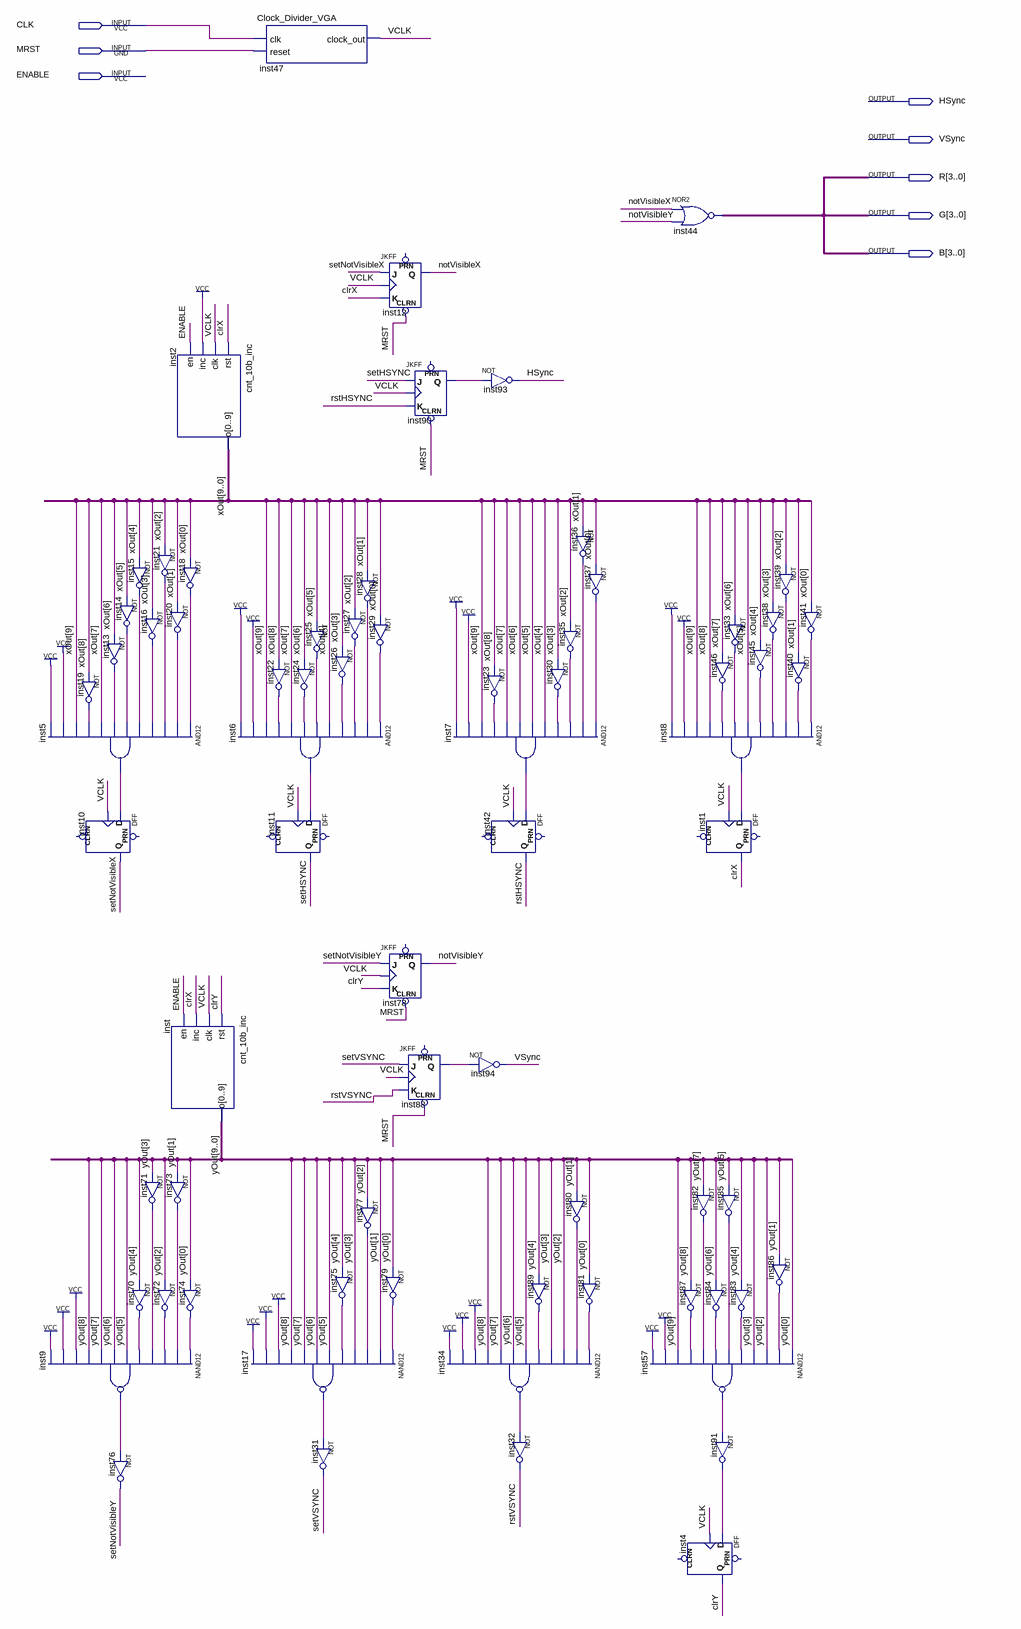
[diagram p0: schematic sheet]
// Quartus schematic VGAcontroller.bdf as structural Verilog: 71 symbols, 8 pins
module VGAcontroller (
  input  CLK,
  input  MRST,
  input  ENABLE,
  output HSync,
  output VSync,
  output [3:0] R,
  output [3:0] G,
  output [3:0] B
);

  wire clrX, clrY, inst5_out, inst6_out, inst7_out, inst8_out, inst9_out, inst13_out, inst14_out, inst15_out,
       inst16_out, inst17_out, inst18_out, inst19_out, inst20_out, inst21_out, inst22_out, inst23_out,
       inst24_out, inst25_out, inst26_out, inst27_out, inst28_out, inst29_out, inst30_out, inst33_out,
       inst34_out, inst35_out, inst36_out, inst37_out, inst38_out, inst39_out, inst40_out, inst41_out,
       inst45_out, inst46_out, inst57_out, inst70_out, inst71_out, inst72_out, inst73_out, inst74_out,
       inst75_out, inst77_out, inst79_out, inst80_out, inst81_out, inst82_out, inst83_out, inst84_out,
       inst85_out, inst86_out, inst87_out, inst88_q, inst89_out, inst90_q, inst91_out, notVisibleX,
       notVisibleY, rstHSYNC, rstVSYNC, setHSYNC, setNotVisibleX, setNotVisibleY, setVSYNC, VCLK;
  wire [9:0] xOut, yOut;

  not inst19 (inst19_out, xOut[8]);
  and inst5 (inst5_out, inst18_out, inst20_out, inst21_out, inst16_out, inst15_out, inst14_out, inst13_out, xOut[7], inst19_out, xOut[9], 1'b1, 1'b1);
  DFF inst10 (.CLK(VCLK), .D(inst5_out), .Q(setNotVisibleX));  // open: CLRN, PRN
  nand inst9 (inst9_out, inst74_out, inst73_out, inst72_out, inst71_out, inst70_out, yOut[5], yOut[6], yOut[7], yOut[8], 1'b1, 1'b1, 1'b1);
  not inst15 (inst15_out, xOut[4]);
  not inst14 (inst14_out, xOut[5]);
  not inst13 (inst13_out, xOut[6]);
  not inst70 (inst70_out, yOut[4]);
  not inst76 (setNotVisibleY, inst9_out);
  cnt_10b_inc inst2 (.rst(clrX), .clk(VCLK), .inc(1'b1), .en(ENABLE), .o(xOut));
  not inst21 (inst21_out, xOut[2]);
  not inst18 (inst18_out, xOut[0]);
  not inst20 (inst20_out, xOut[1]);
  not inst16 (inst16_out, xOut[3]);
  cnt_10b_inc inst (.rst(clrY), .clk(VCLK), .inc(clrX), .en(ENABLE), .o(yOut));
  not inst71 (inst71_out, yOut[3]);
  not inst73 (inst73_out, yOut[1]);
  not inst72 (inst72_out, yOut[2]);
  not inst74 (inst74_out, yOut[0]);
  and inst6 (inst6_out, inst29_out, inst28_out, inst27_out, inst26_out, xOut[4], inst25_out, inst24_out, xOut[7], inst22_out, xOut[9], 1'b1, 1'b1);
  Clock_Divider_VGA inst47 (.clk(CLK), .reset(MRST), .clock_out(VCLK));
  not inst22 (inst22_out, xOut[8]);
  DFF inst11 (.CLK(VCLK), .D(inst6_out), .Q(setHSYNC));  // open: CLRN, PRN
  nand inst17 (inst17_out, inst79_out, yOut[1], inst77_out, yOut[3], inst75_out, yOut[5], yOut[6], yOut[7], yOut[8], 1'b1, 1'b1, 1'b1);
  not inst25 (inst25_out, xOut[5]);
  not inst26 (inst26_out, xOut[3]);
  not inst24 (inst24_out, xOut[6]);
  not inst75 (inst75_out, yOut[4]);
  not inst31 (setVSYNC, inst17_out);
  JKFF inst12 (.CLRN(MRST), .K(clrX), .J(setNotVisibleX), .CLK(VCLK), .Q(notVisibleX));  // open: PRN
  not inst28 (inst28_out, xOut[1]);
  not inst27 (inst27_out, xOut[2]);
  not inst29 (inst29_out, xOut[0]);
  JKFF inst78 (.CLRN(MRST), .K(clrY), .J(setNotVisibleY), .CLK(VCLK), .Q(notVisibleY));  // open: PRN
  not inst77 (inst77_out, yOut[2]);
  not inst79 (inst79_out, yOut[0]);
  JKFF inst90 (.CLRN(MRST), .K(rstHSYNC), .J(setHSYNC), .CLK(VCLK), .Q(inst90_q));  // open: PRN
  JKFF inst88 (.CLRN(MRST), .K(rstVSYNC), .J(setVSYNC), .CLK(VCLK), .Q(inst88_q));  // open: PRN
  nand inst34 (inst34_out, inst81_out, inst80_out, yOut[2], yOut[3], inst89_out, yOut[5], yOut[6], yOut[7], yOut[8], 1'b1, 1'b1, 1'b1);
  not inst93 (HSync, inst90_q);
  not inst23 (inst23_out, xOut[8]);
  and inst7 (inst7_out, inst37_out, inst36_out, inst35_out, inst30_out, xOut[4], xOut[5], xOut[6], xOut[7], inst23_out, xOut[9], 1'b1, 1'b1);
  DFF inst42 (.CLK(VCLK), .D(inst7_out), .Q(rstHSYNC));  // open: CLRN, PRN
  not inst94 (VSync, inst88_q);
  not inst89 (inst89_out, yOut[4]);
  not inst32 (rstVSYNC, inst34_out);
  not inst36 (inst36_out, xOut[1]);
  not inst37 (inst37_out, xOut[0]);
  not inst35 (inst35_out, xOut[2]);
  not inst30 (inst30_out, xOut[3]);
  not inst80 (inst80_out, yOut[1]);
  not inst81 (inst81_out, yOut[0]);
  nand inst57 (inst57_out, yOut[0], inst86_out, yOut[2], yOut[3], inst83_out, inst85_out, inst84_out, inst82_out, inst87_out, yOut[9], 1'b1, 1'b1);
  assign B = ~({4{notVisibleX}} | {4{notVisibleY}});  // NOR2 inst44, 4 bits wide
  and inst8 (inst8_out, inst41_out, inst40_out, inst39_out, inst38_out, inst45_out, xOut[5], inst33_out, inst46_out, xOut[8], xOut[9], 1'b1, 1'b1);
  not inst82 (inst82_out, yOut[7]);
  not inst87 (inst87_out, yOut[8]);
  DFF inst4 (.CLK(VCLK), .D(inst91_out), .Q(clrY));  // open: CLRN, PRN
  not inst33 (inst33_out, xOut[6]);
  not inst46 (inst46_out, xOut[7]);
  DFF inst1 (.CLK(VCLK), .D(inst8_out), .Q(clrX));  // open: CLRN, PRN
  not inst85 (inst85_out, yOut[5]);
  not inst83 (inst83_out, yOut[4]);
  not inst84 (inst84_out, yOut[6]);
  not inst91 (inst91_out, inst57_out);
  not inst39 (inst39_out, xOut[2]);
  not inst38 (inst38_out, xOut[3]);
  not inst45 (inst45_out, xOut[4]);
  not inst40 (inst40_out, xOut[1]);
  not inst86 (inst86_out, yOut[1]);
  not inst41 (inst41_out, xOut[0]);

  assign G = B;
  assign R = B;
endmodule
